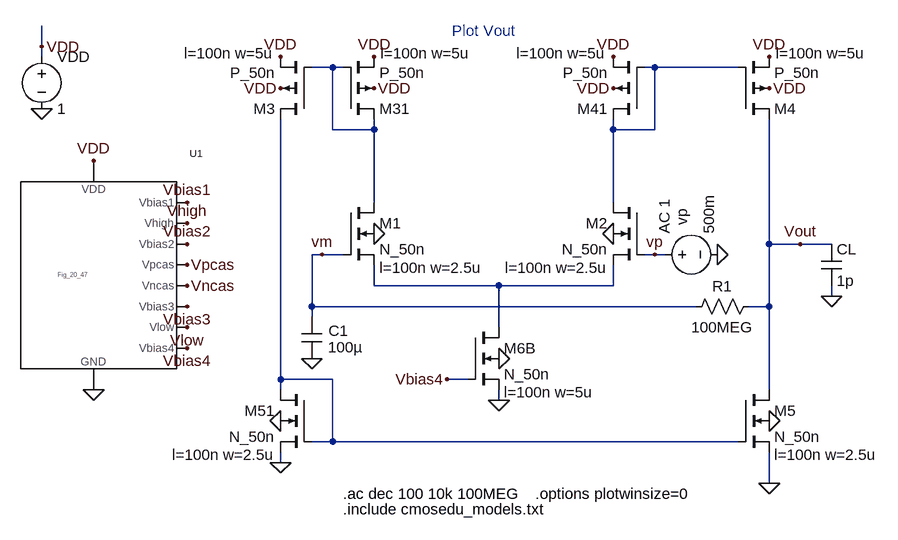
[diagram p0: schematic Fig24_34.asc]
Fig24_34.asc, the LTspice schematic file:
Version 4
SHEET 1 2652 680
WIRE 864 -592 864 -624
WIRE 864 -576 864 -592
WIRE 1312 -560 1280 -560
WIRE 1328 -560 1312 -560
WIRE 1808 -560 1792 -560
WIRE 1936 -560 1808 -560
WIRE 1312 -464 1312 -560
WIRE 1376 -464 1376 -480
WIRE 1376 -464 1312 -464
WIRE 1744 -464 1744 -480
WIRE 1808 -464 1808 -560
WIRE 1808 -464 1744 -464
WIRE 1376 -352 1376 -464
WIRE 1744 -352 1744 -464
WIRE 1984 -288 1984 -480
WIRE 2032 -288 1984 -288
WIRE 2080 -288 2032 -288
WIRE 1296 -272 1280 -272
WIRE 1328 -272 1296 -272
WIRE 1808 -272 1792 -272
WIRE 1824 -272 1808 -272
WIRE 1376 -224 1376 -256
WIRE 1568 -224 1376 -224
WIRE 1744 -224 1744 -256
WIRE 1744 -224 1568 -224
WIRE 2080 -208 2080 -224
WIRE 1280 -192 1280 -272
WIRE 1872 -192 1280 -192
WIRE 1984 -192 1984 -288
WIRE 1984 -192 1952 -192
WIRE 1280 -176 1280 -192
WIRE 1568 -160 1568 -224
WIRE 1232 -80 1232 -480
WIRE 1312 -80 1232 -80
WIRE 1520 -80 1488 -80
WIRE 1232 -64 1232 -80
WIRE 1984 -64 1984 -192
WIRE 1568 -48 1568 -64
WIRE 1312 16 1312 -80
WIRE 1312 16 1280 16
WIRE 1936 16 1312 16
WIRE 1232 48 1232 32
WIRE 1984 80 1984 32
FLAG 864 -496 0
FLAG 864 -592 VDD
FLAG 1744 -304 0
FLAG 1568 -48 0
FLAG 1376 -304 0
FLAG 1232 -528 VDD
FLAG 944 -416 VDD
FLAG 944 -64 0
FLAG 1088 -352 Vbias1
FLAG 1088 -320 Vhigh
FLAG 1088 -288 Vbias2
FLAG 1088 -192 Vbias3
FLAG 1088 -256 Vpcas
FLAG 1088 -224 Vncas
FLAG 1088 -128 Vbias4
FLAG 1088 -160 Vlow
FLAG 1232 -576 VDD
FLAG 1568 -112 0
FLAG 1488 -80 Vbias4
FLAG 1904 -272 0
FLAG 1296 -272 vm
FLAG 1808 -272 vp
FLAG 1232 48 0
FLAG 1232 -16 0
FLAG 1984 -528 VDD
FLAG 1984 -16 0
FLAG 1984 80 0
FLAG 1984 -576 VDD
FLAG 2032 -288 Vout
FLAG 1280 -112 0
FLAG 2080 -208 0
FLAG 1376 -528 VDD
FLAG 1376 -576 VDD
FLAG 1744 -576 VDD
FLAG 1744 -528 VDD
SYMBOL voltage 864 -592 R0
WINDOW 123 0 0 Left 2
WINDOW 39 0 0 Left 2
SYMATTR InstName VDD
SYMATTR Value 1
SYMBOL nmos4 1792 -352 M0
WINDOW 123 56 100 Left 2
SYMATTR Value2 l=100n w=2.5u
SYMATTR InstName M2
SYMATTR Value N_50n
SYMBOL nmos4 1328 -352 R0
WINDOW 123 56 100 Left 2
SYMATTR Value2 l=100n w=2.5u
SYMATTR InstName M1
SYMATTR Value N_50n
SYMBOL pmos4 1280 -480 R180
WINDOW 123 58 102 Left 2
WINDOW 0 56 16 Left 2
SYMATTR Value2 l=100n w=5u
SYMATTR InstName M3
SYMATTR Value P_50n
SYMBOL Fig_20_47 944 -240 R0
SYMATTR InstName U1
SYMBOL nmos4 1520 -160 R0
WINDOW 123 56 100 Left 2
SYMATTR Value2 l=100n w=5u
SYMATTR InstName M6B
SYMATTR Value N_50n
SYMBOL voltage 1808 -272 R270
WINDOW 0 45 42 Left 2
WINDOW 3 31 83 Left 2
WINDOW 39 0 0 Left 2
WINDOW 123 32 15 Left 2
SYMATTR InstName vp
SYMATTR Value 500m
SYMATTR Value2 AC 1
SYMBOL nmos4 1280 -64 M0
WINDOW 123 56 100 Left 2
SYMATTR Value2 l=100n w=2.5u
SYMATTR InstName M51
SYMATTR Value N_50n
SYMBOL pmos4 1936 -480 M180
WINDOW 123 58 102 Left 2
WINDOW 0 56 16 Left 2
SYMATTR Value2 l=100n w=5u
SYMATTR InstName M4
SYMATTR Value P_50n
SYMBOL nmos4 1936 -64 R0
WINDOW 123 56 100 Left 2
SYMATTR Value2 l=100n w=2.5u
SYMATTR InstName M5
SYMATTR Value N_50n
SYMBOL res 1856 -176 R270
WINDOW 0 32 56 VTop 2
WINDOW 3 0 56 VBottom 2
SYMATTR InstName R1
SYMATTR Value 100MEG
SYMBOL cap 2064 -288 R0
SYMATTR InstName CL
SYMATTR Value 1p
SYMBOL pmos4 1328 -480 M180
WINDOW 123 58 102 Left 2
WINDOW 0 56 16 Left 2
SYMATTR Value2 l=100n w=5u
SYMATTR InstName M31
SYMATTR Value P_50n
SYMBOL pmos4 1792 -480 R180
WINDOW 123 58 102 Left 2
WINDOW 0 56 16 Left 2
SYMATTR Value2 l=100n w=5u
SYMATTR InstName M41
SYMATTR Value P_50n
SYMBOL cap 1264 -176 R0
WINDOW 0 42 21 Left 2
WINDOW 3 41 47 Left 2
SYMATTR InstName C1
SYMATTR Value 100µ
TEXT 1328 120 Left 2 !.include cmosedu_models.txt
TEXT 1496 -616 Left 2 ;Plot Vout
TEXT 1328 96 Left 2 !.ac dec 100 10k 100MEG
TEXT 1624 96 Left 2 !.options plotwinsize=0

The netlist it stands for:
* Fig24_34.asc
VDD VDD 0 1
M2 N002 vp N003 0 N_50n l=100n w=2.5u
M1 N001 vm N003 0 N_50n l=100n w=2.5u
M3 N004 N001 VDD VDD P_50n l=100n w=5u
XU1 Vbias1 Vhigh Vbias2 Vpcas Vncas Vbias3 Vlow Vbias4 VDD 0 Fig_20_47  ; pins Vbias1 Vhigh Vbias2 Vpcas Vncas Vbias3 Vlow Vbias4 VDD GND
M6B N003 Vbias4 0 0 N_50n l=100n w=5u
vp vp 0 500m AC 1
M51 N004 N004 0 0 N_50n l=100n w=2.5u
M4 Vout N002 VDD VDD P_50n l=100n w=5u
M5 Vout N004 0 0 N_50n l=100n w=2.5u
R1 vm Vout 100MEG
CL Vout 0 1p
M31 N001 N001 VDD VDD P_50n l=100n w=5u
M41 N002 N002 VDD VDD P_50n l=100n w=5u
C1 vm 0 100µ
.model NMOS NMOS
.model PMOS PMOS
.lib standard.mos
.include cmosedu_models.txt
* Plot Vout
.ac dec 100 10k 100MEG
.options plotwinsize=0
.backanno
.end